# Altium schematic sheet [07] - FPGA IO.SchDoc
size A3
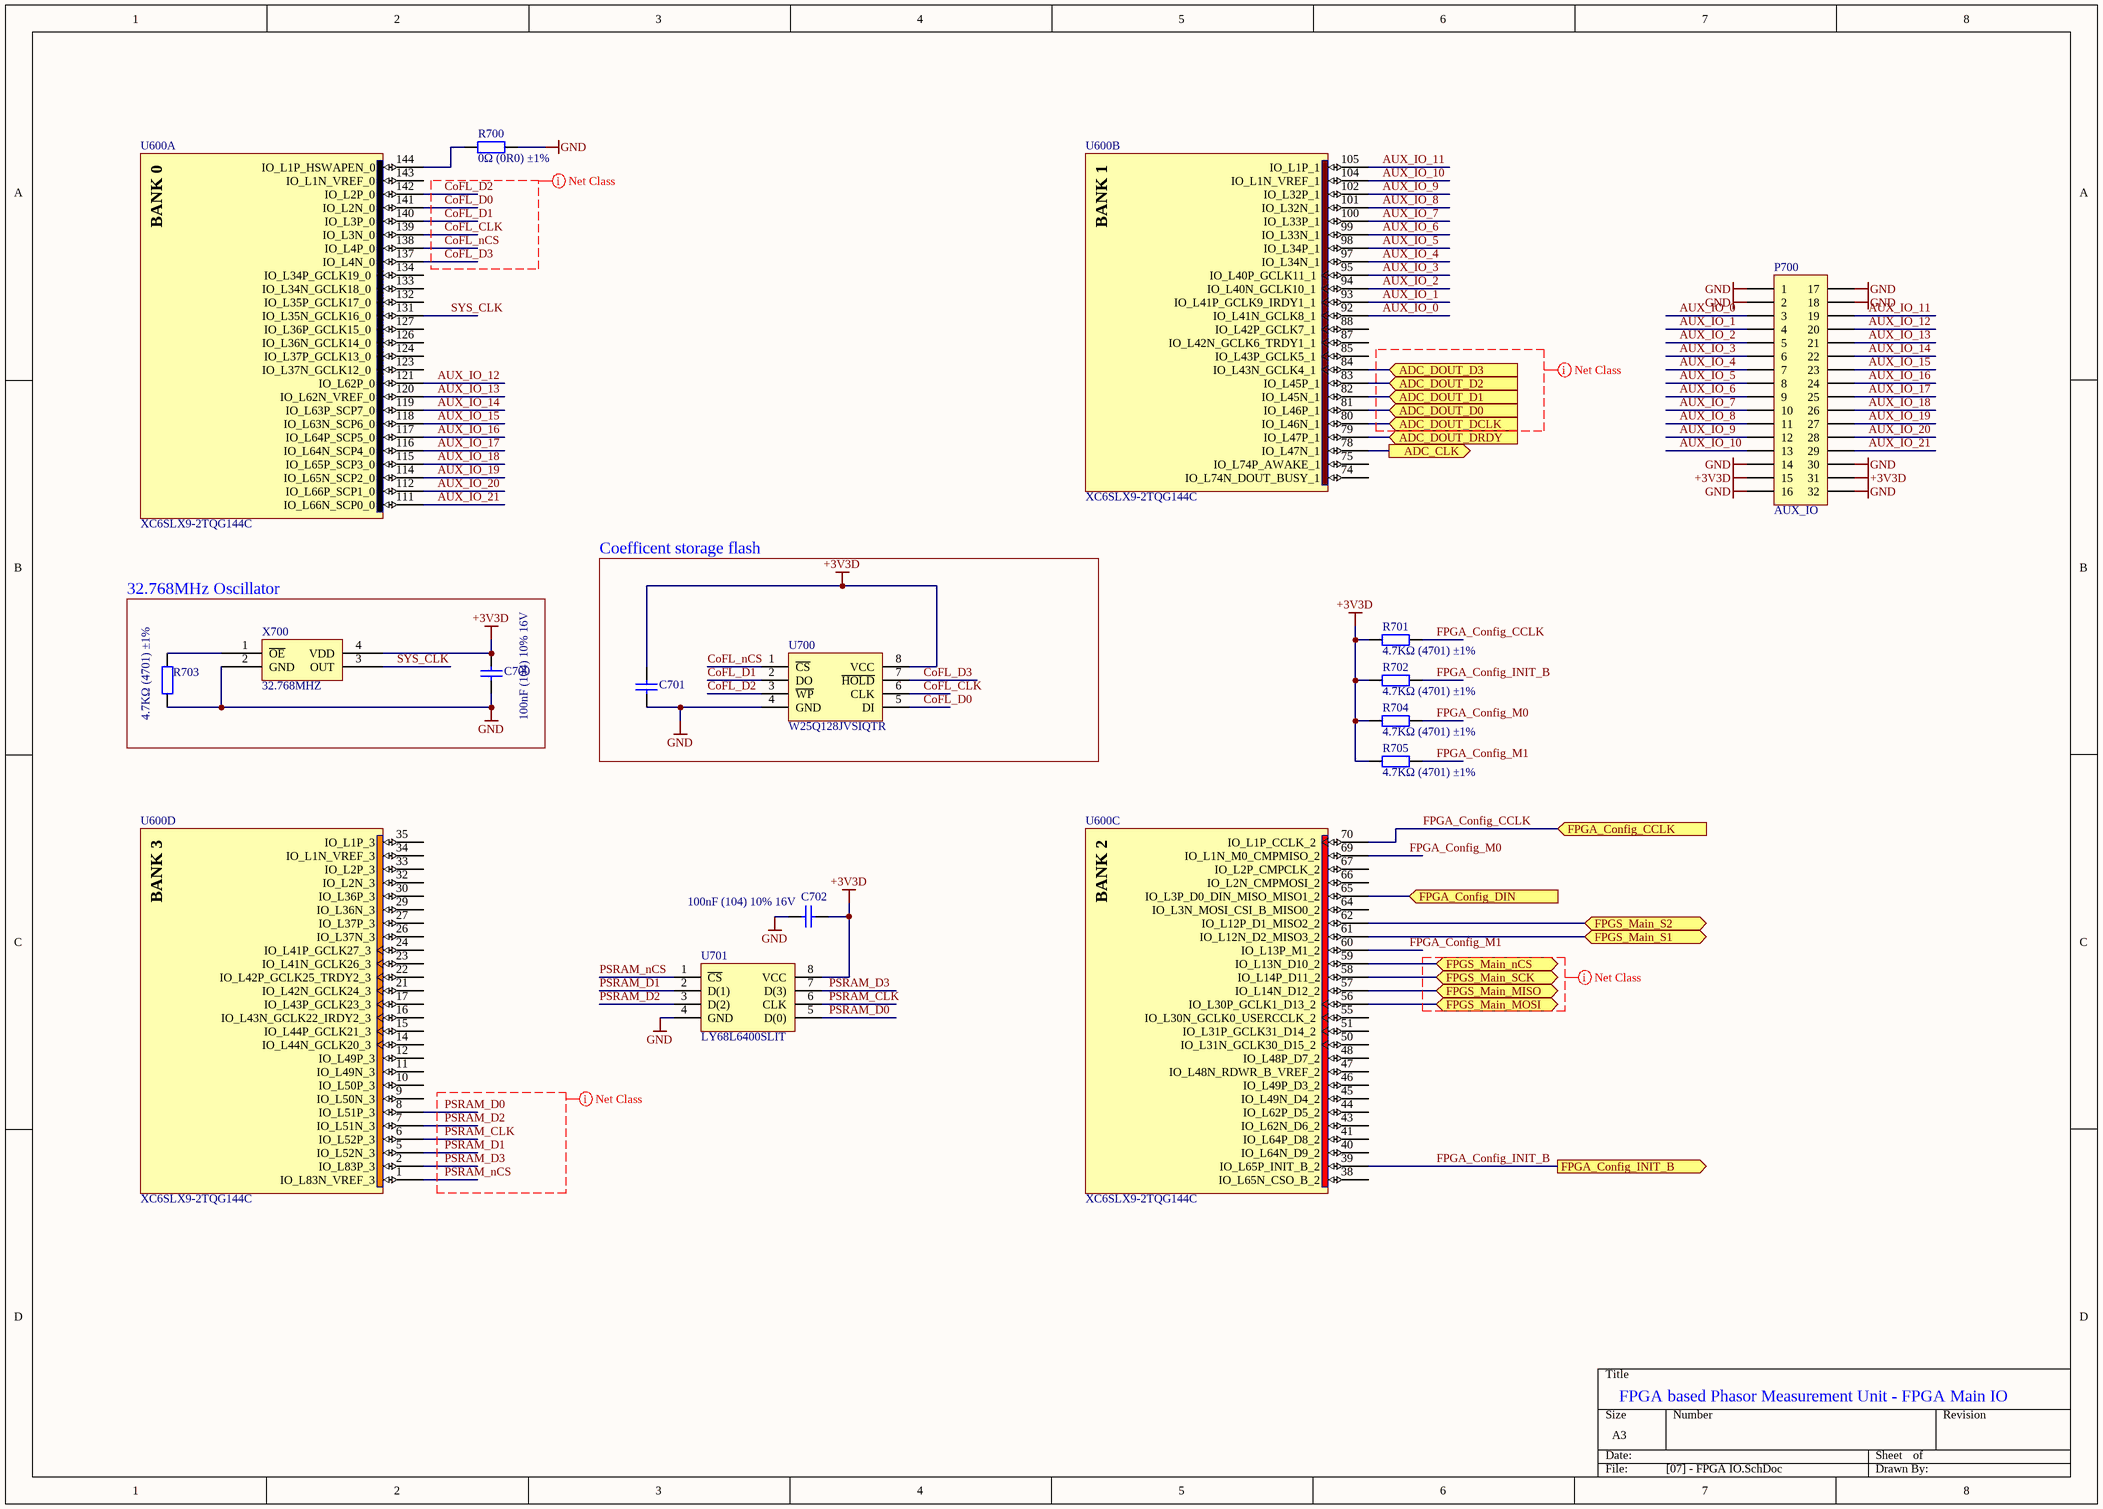
[diagram p0: [07] - FPGA IO.SchDoc]

## Parts
C700  100nF (104) 10% 16V  [0402_C]
C701  100nF (104) 10% 16V  [0402_C]  (value not drawn)
C702  100nF (104) 10% 16V  [0402_C]
P700  AUX_IO  [HDR2X16_CEN]
R700  0Ω (0R0) ±1%  [0402_R]
R701  4.7KΩ (4701) ±1%  [0402_R]
R702  4.7KΩ (4701) ±1%  [0402_R]
R703  4.7KΩ (4701) ±1%  [0402_R]
R704  4.7KΩ (4701) ±1%  [0402_R]
R705  4.7KΩ (4701) ±1%  [0402_R]
U600  XC6SLX9-2TQG144C  [TQG144_N]  (parts A,B,C,D of 7)
U700  W25Q128JVSIQTR  [SOIC-8_208mil]
U701  LY68L6400SLIT  [SOIC-8_208mil]
X700  32.768MHZ  [7050 Clock]

## Blocks framed on the sheet
Coefficent storage flash: C701 U700
32.768MHz Oscillator: C700 R703 X700

## Ports
ADC_CLK (out), ADC_DOUT_D0 (in), ADC_DOUT_D1 (in), ADC_DOUT_D2 (in), ADC_DOUT_D3 (in), ADC_DOUT_DCLK (in), ADC_DOUT_DRDY (in), FPGA_Config_CCLK (in), FPGA_Config_DIN (in), FPGA_Config_INIT_B (out), FPGS_Main_MISO (bidir), FPGS_Main_MOSI (bidir), FPGS_Main_nCS (bidir), FPGS_Main_S1 (bidir), FPGS_Main_S2 (bidir), FPGS_Main_SCK (bidir)

## Nets
+3V3D: C700.2 C701.2 C702.1 P700.15 P700.31 R701.2 R702.2 R704.2 R705.2 U700.8(VCC) U701.8(VCC) X700.4(VDD)
GND: C700.1 C701.1 C702.2 P700.1 P700.2 P700.14 P700.16 P700.17 P700.18 P700.30 P700.32 R700.2 R703.1 U700.4(GND) U701.4(GND) X700.2(GND)
ADC_CLK: U600.78(IO_L47N_1) ; port ADC_CLK
ADC_DOUT_D0: U600.81(IO_L46P_1) ; port ADC_DOUT_D0
ADC_DOUT_D1: U600.82(IO_L45N_1) ; port ADC_DOUT_D1
ADC_DOUT_D2: U600.83(IO_L45P_1) ; port ADC_DOUT_D2
ADC_DOUT_D3: U600.84(IO_L43N_GCLK4_1) ; port ADC_DOUT_D3
ADC_DOUT_DCLK: U600.80(IO_L46N_1) ; port ADC_DOUT_DCLK
ADC_DOUT_DRDY: U600.79(IO_L47P_1) ; port ADC_DOUT_DRDY
AUX_IO_0: P700.3 U600.92(IO_L41N_GCLK8_1)
AUX_IO_1: P700.4 U600.93(IO_L41P_GCLK9_IRDY1_1)
AUX_IO_2: P700.5 U600.94(IO_L40N_GCLK10_1)
AUX_IO_3: P700.6 U600.95(IO_L40P_GCLK11_1)
AUX_IO_4: P700.7 U600.97(IO_L34N_1)
AUX_IO_5: P700.8 U600.98(IO_L34P_1)
AUX_IO_6: P700.9 U600.99(IO_L33N_1)
AUX_IO_7: P700.10 U600.100(IO_L33P_1)
AUX_IO_8: P700.11 U600.101(IO_L32N_1)
AUX_IO_9: P700.12 U600.102(IO_L32P_1)
AUX_IO_10: P700.13 U600.104(IO_L1N_VREF_1)
AUX_IO_11: P700.19 U600.105(IO_L1P_1)
AUX_IO_12: P700.20 U600.121(IO_L62P_0)
AUX_IO_13: P700.21 U600.120(IO_L62N_VREF_0)
AUX_IO_14: P700.22 U600.119(IO_L63P_SCP7_0)
AUX_IO_15: P700.23 U600.118(IO_L63N_SCP6_0)
AUX_IO_16: P700.24 U600.117(IO_L64P_SCP5_0)
AUX_IO_17: P700.25 U600.116(IO_L64N_SCP4_0)
AUX_IO_18: P700.26 U600.115(IO_L65P_SCP3_0)
AUX_IO_19: P700.27 U600.114(IO_L65N_SCP2_0)
AUX_IO_20: P700.28 U600.112(IO_L66P_SCP1_0)
AUX_IO_21: P700.29 U600.111(IO_L66N_SCP0_0)
CoFL_CLK: U600.139(IO_L3N_0) U700.6(CLK)
CoFL_D0: U600.141(IO_L2N_0) U700.5(DI)
CoFL_D1: U600.140(IO_L3P_0) U700.2(DO)
CoFL_D2: U600.142(IO_L2P_0) U700.3(~{WP})
CoFL_D3: U600.137(IO_L4N_0) U700.7(~{HOLD})
CoFL_nCS: U600.138(IO_L4P_0) U700.1(~{CS})
FPGA_Config_CCLK: R701.1 U600.70(IO_L1P_CCLK_2) ; port FPGA_Config_CCLK
FPGA_Config_DIN: U600.65(IO_L3P_D0_DIN_MISO_MISO1_2) ; port FPGA_Config_DIN
FPGA_Config_INIT_B: R702.1 U600.39(IO_L65P_INIT_B_2) ; port FPGA_Config_INIT_B
FPGA_Config_M0: R704.1 U600.69(IO_L1N_M0_CMPMISO_2)
FPGA_Config_M1: R705.1 U600.60(IO_L13P_M1_2)
FPGS_Main_MISO: U600.57(IO_L14N_D12_2) ; port FPGS_Main_MISO
FPGS_Main_MOSI: U600.56(IO_L30P_GCLK1_D13_2) ; port FPGS_Main_MOSI
FPGS_Main_nCS: U600.59(IO_L13N_D10_2) ; port FPGS_Main_nCS
FPGS_Main_S1: U600.61(IO_L12N_D2_MISO3_2) ; port FPGS_Main_S1
FPGS_Main_S2: U600.62(IO_L12P_D1_MISO2_2) ; port FPGS_Main_S2
FPGS_Main_SCK: U600.58(IO_L14P_D11_2) ; port FPGS_Main_SCK
PSRAM_CLK: U600.6(IO_L52P_3) U701.6(CLK)
PSRAM_D0: U600.8(IO_L51P_3) U701.5(D(0))
PSRAM_D1: U600.5(IO_L52N_3) U701.2(D(1))
PSRAM_D2: U600.7(IO_L51N_3) U701.3(D(2))
PSRAM_D3: U600.2(IO_L83P_3) U701.7(D(3))
PSRAM_nCS: U600.1(IO_L83N_VREF_3) U701.1(~{CS})
SYS_CLK: U600.131(IO_L35N_GCLK16_0) X700.3(OUT)
NetR700_1: R700.1 U600.144(IO_L1P_HSWAPEN_0)
NetR703_2: R703.2 X700.1(~{OE})

Not connected (* = marked no-connect by the designer): U600 9(IO_L50N_3) 10(IO_L50P_3) 11(IO_L49N_3) 12(IO_L49P_3) 14(IO_L44N_GCLK20_3) 15(IO_L44P_GCLK21_3) 16(IO_L43N_GCLK22_IRDY2_3) 17(IO_L43P_GCLK23_3) 21(IO_L42N_GCLK24_3) 22(IO_L42P_GCLK25_TRDY2_3) 23(IO_L41N_GCLK26_3) 24(IO_L41P_GCLK27_3) 26(IO_L37N_3) 27(IO_L37P_3) 29(IO_L36N_3) 30(IO_L36P_3) 32(IO_L2N_3) 33(IO_L2P_3) 34(IO_L1N_VREF_3) 35(IO_L1P_3) 38(IO_L65N_CSO_B_2) 40(IO_L64N_D9_2) 41(IO_L64P_D8_2) 43(IO_L62N_D6_2) 44(IO_L62P_D5_2) 45(IO_L49N_D4_2) 46(IO_L49P_D3_2) 47(IO_L48N_RDWR_B_VREF_2) 48(IO_L48P_D7_2) 50(IO_L31N_GCLK30_D15_2) 51(IO_L31P_GCLK31_D14_2) 55(IO_L30N_GCLK0_USERCCLK_2) 64(IO_L3N_MOSI_CSI_B_MISO0_2) 66(IO_L2N_CMPMOSI_2) 67(IO_L2P_CMPCLK_2) 74(IO_L74N_DOUT_BUSY_1) 75(IO_L74P_AWAKE_1) 85(IO_L43P_GCLK5_1) 87(IO_L42N_GCLK6_TRDY1_1) 88(IO_L42P_GCLK7_1) 123(IO_L37N_GCLK12_0) 124(IO_L37P_GCLK13_0) 126(IO_L36N_GCLK14_0) 127(IO_L36P_GCLK15_0) 132(IO_L35P_GCLK17_0) 133(IO_L34N_GCLK18_0) 134(IO_L34P_GCLK19_0) 143(IO_L1N_VREF_0)

## Layout directives
net class QSPI_FLASH: CoFL_CLK, CoFL_D0, CoFL_D1, CoFL_D2, CoFL_D3, CoFL_nCS
net class PSRAM: PSRAM_CLK, PSRAM_D0, PSRAM_D1, PSRAM_D2, PSRAM_D3, PSRAM_nCS
net class ADC_DOUT: (no net found under the mark)
net class FPGA_Main_SPI: (no net found under the mark)

## Notes on the sheet
- FPGA based Phasor Measurement Unit - FPGA Main IO
- (in symbol CMP-0067-00454-1, part A) BANK 0
- (in symbol CMP-0067-00454-1, part B) BANK 1
- (in symbol CMP-0067-00454-1, part C) BANK 2
- (in symbol CMP-0067-00454-1, part D) BANK 3

## Library data of the parts
C700-C702 = 0402 100nF (104) 10% 16V: 贴片电容; ComponentLink1Description: 供应商链接; ComponentLink1URL: http://www.szlcsc.com/product/details_1877.html; Package: 0402; Supplier: LC; SuppliersPartNumber: C1525
P700 = Header 16X2A: Header, 16-Pin, Dual row; LatestRevisionDate: 17-Jul-2002; LatestRevisionNote: Re-released for DXP Platform.; Publisher: Altium Limited; JLCPCB: NO
R700 = 0402 0Ω (0R0) 1%: 贴片电阻; ComponentLink1Description: 供应商链接; ComponentLink1URL: http://www.szlcsc.com/product/details_17853.html; Package: 0402; Supplier: LC; SuppliersPartNumber: C17168
R701-R705 = 0402 4.7KΩ (4701) 1%: 贴片电阻; ComponentLink1Description: 供应商链接; ComponentLink1URL: http://www.szlcsc.com/product/details_26643.html; Package: 0402; Supplier: LC; SuppliersPartNumber: C25900
U600 = CMP-0067-00454-1: Spartan-6 LX 1.2V FPGA, 102 User I/Os, 144-Pin TQFP (0.5mm Pitch), Speed Grade 2, Commercial Grade, Pb-Free; PackageVersion: ver1.2, Jun-2004; DatasheetVersion: ver1.6, Nov-2010; PackageDescription: 144-Pin Thin Quad Flat Pack (TQG144) - Pb-Free; PackageReference: TQG144; Code_JEDEC: MS-026-BFB
U700 = W25Q128JVSIQTR_[C97521]: Flash ROM; ComponentLink1Description: 供应商链接; ComponentLink1URL: https://item.szlcsc.com/98729.html; Package: SOIC-8; Supplier: LC; SuppliersPartNumber: C97521
U701 = LY68L6400SLIT: Pseudo SRAM; ComponentLink1Description: 供应商链接; ComponentLink1URL: https://item.szlcsc.com/98729.html; Package: SOIC-8; Supplier: LC; SuppliersPartNumber: C261881
X700 = OCETDLJANF-32.768MHZ: SMD OSCILLATORS(XO) 32.768MHZ ±25PPM SMD-7050_4P ROHS; SuppliersPartNumber: C70525